# Altium schematic sheet TOWRP.SchDoc
size A; Organization: Smart Product Design Lab; Address1: 201 Thornton; Address2: Stanford University; Address3: Stanford, CA; Address4: 94305-4021
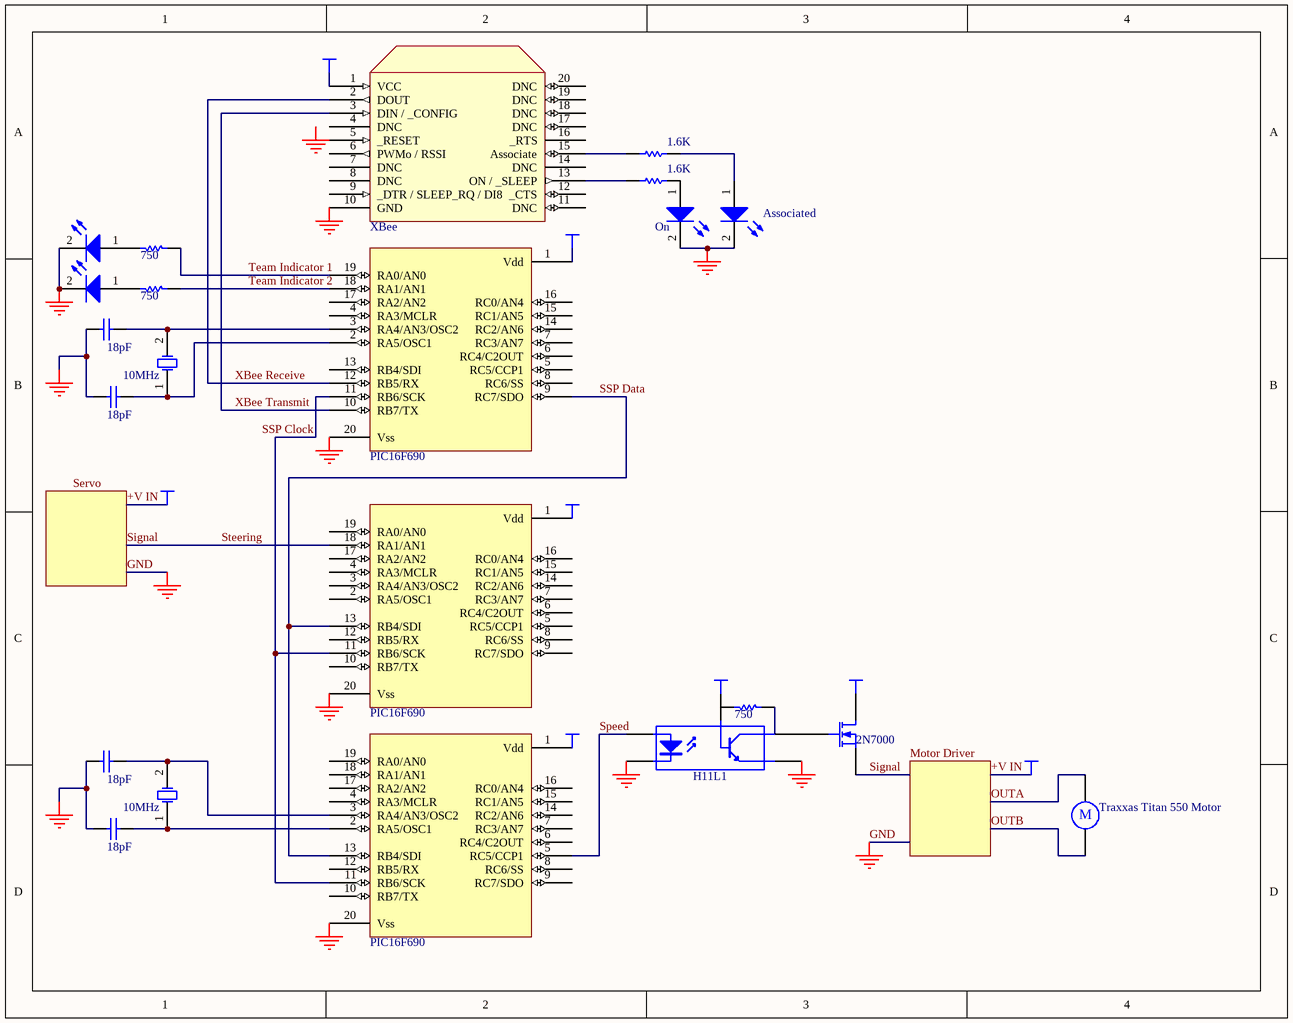
[diagram p0: TOWRP.SchDoc]

## Parts
(Parts that share a designator on the sheet are numbered #1, #2 ... from top to bottom, then left to right.)
?  Traxxas Titan 550 Motor  [RB5-10.5]
C5#1  value 18pF  [RAD-0.1]  (hidden comment: Cap)
C5#2  value 18pF  [RAD-0.1]  (hidden comment: Cap)
C6#1  value 18pF  [RAD-0.1]  (hidden comment: Cap)
C6#2  value 18pF  [RAD-0.1]  (hidden comment: Cap)
D1  On  [LED]
D2  Associated  [LED]
D3  On  [LED]  (value not drawn)
D4  On  [LED]  (value not drawn)
Q?  2N7000  [BCY-W3/H.8]
R1  value 1.6K  [RAD-0.1]  (hidden comment: Res1)
R2  value 1.6K  [RAD-0.1]  (hidden comment: Res1)
R3#1  value 750  [RAD-0.1]  (hidden comment: Res1)
R3#2  value 750  [RAD-0.1]  (hidden comment: Res1)
R4  value 750  [RAD-0.1]  (hidden comment: Res1)
U2  XBee  [XBee sockets]
U3#1  (no value)  [DIP-20]
U3#2  (no value)  [DIP-20]
U3#3  (no value)  [DIP-20]
U?  H11L1  [SO-G5/P.95]
Y1#1  10MHz  [BCY-W2/D3.1]
Y1#2  10MHz  [BCY-W2/D3.1]

## Nets
+3.3: U2.1(VCC) U3#1.1(Vdd)
+V IN: Q?.1(D) U3#2.1(Vdd) U3#3.1(Vdd) U?.3(B)  [also labelled +5, +7.2]
GND: C5#1.2 C5#2.2 C6#1.2 C6#2.2 D1.2(K) D2.2(K) D3.2(K) D4.2(K) U2.10(GND) U3#1.20(Vss) U3#2.20(Vss) U3#3.20(Vss) U?.2(K) U?.5(E)
OUTA: ?.1
OUTB: ?.2
Signal: Q?.3(S) U3#2.18(RA1/AN1)  [also labelled Steering]
Speed: U3#3.5(RC5/CCP1) U?.1(A)
SSP Data: U3#1.9(RC7/SDO) U3#2.13(RB4/SDI) U3#3.13(RB4/SDI)
Team Indicator 1: R3#1.2 U3#1.19(RA0/AN0)
Team Indicator 2: R4.2 U3#1.18(RA1/AN1)
XBee Receive: U2.2(DOUT) U3#1.12(RB5/RX)
XBee Transmit: U2.3(DIN_/__CONFIG) U3#1.10(RB7/TX)
NetC5#1_1: C5#1.1 U3#1.3(RA4/AN3/OSC2) Y1#1.2(OSC2)
NetC5#2_1: C5#2.1 U3#3.3(RA4/AN3/OSC2) Y1#2.2(OSC2)
NetC6#1_1: C6#1.1 U3#1.2(RA5/OSC1) Y1#1.1(OSC1)
NetC6#2_1: C6#2.1 U3#3.2(RA5/OSC1) Y1#2.1(OSC1)
NetD1_1: D1.1(A) R2.2
NetD2_1: D2.1(A) R1.2
NetD3_1: D3.1(A) R3#1.1
NetD4_1: D4.1(A) R4.1
NetQ?_2: Q?.2(G) U?.4(C)
NetR1_1: R1.1 U2.15(Associate)
NetR2_1: R2.1 U2.13(ON_/__SLEEP)
NetU3#1_11: U3#1.11(RB6/SCK) U3#2.11(RB6/SCK) U3#3.11(RB6/SCK)

Not connected (* = marked no-connect by the designer): R3#2 1 2; U2 4(DNC) 5(_RESET) 6(PWMo_/_RSSI) 7(DNC) 8(DNC) 9(_DTR_/_SLEEP_RQ_/_DI8) 11(DNC) 12(_CTS) 14(DNC) 16(_RTS) 17(DNC) 18(DNC) 19(DNC) 20(DNC); U3#1 4(RA3/MCLR) 5(RC5/CCP1) 6(RC4/C2OUT) 7(RC3/AN7) 8(RC6/SS) 13(RB4/SDI) 14(RC2/AN6) 15(RC1/AN5) 16(RC0/AN4) 17(RA2/AN2); U3#2 2(RA5/OSC1) 3(RA4/AN3/OSC2) 4(RA3/MCLR) 5(RC5/CCP1) 6(RC4/C2OUT) 7(RC3/AN7) 8(RC6/SS) 9(RC7/SDO) 10(RB7/TX) 12(RB5/RX) 14(RC2/AN6) 15(RC1/AN5) 16(RC0/AN4) 17(RA2/AN2) 19(RA0/AN0); U3#3 4(RA3/MCLR) 6(RC4/C2OUT) 7(RC3/AN7) 8(RC6/SS) 9(RC7/SDO) 10(RB7/TX) 12(RB5/RX) 14(RC2/AN6) 15(RC1/AN5) 16(RC0/AN4) 17(RA2/AN2) 18(RA1/AN1) 19(RA0/AN0)

## Notes on the sheet
- Labels drawn without touching a wire or pin: GND, Motor Driver, Servo, SSP Clock
- Title
- Size:
- Date:
- File:
- A
- Number:
- Time:
- Revision:
- Sheet
- of
- Drawn By:
- (in symbol Motor) M

## Library data of the parts
? = Motor: Motor, General Kind; Manufacturer: Generic Components; Published: 1999
C5#1 C5#2 C6#1 C6#2 = Cap: Capacitor; Manufacturer: Generic Components; Class: Passive; Published: 08/06/2000; Publisher: Altium Hobart Technology Centre; SubClass: Capacitor
D1 D3 D4 = LED1: HLMP1700; Manufacturer: Generic Components; Class: Optoelectronic; Published: 08/06/2000; Publisher: Altium Hobart Technology Centre; SubClass: LED
D2 = LED1: HLMP1790; Manufacturer: Generic Components; Class: Optoelectronic; Published: 08/06/2000; Publisher: Altium Hobart Technology Centre; SubClass: LED
Q? = MOSFET-N: N-Channel MOSFET; Manufacturer: Generic Components; Class: Discrete; SubClass: MOSFET - Low Power; Published: 08/06/2000; Publisher: Altium Hobart Technology Centre
R1 R2 R3#1 R3#2 R4 = Res1: Resistor; Manufacturer: Generic Components; Class: Passive; Published: 08/06/2000; Publisher: Altium Hobart Technology Centre; SubClass: Resistor
U2 = XBee: MaxStream Zibee RF radio module
U3#1-U3#3 = PIC16F690
U? = Optoisolator2: Optoisolator; Manufacturer: Generic Components; Class: Optoelectronic; Published: 1999
Y1#1 Y1#2 = XTAL: Crystal Oscillator; Manufacturer: Generic Components; Published: 08/06/2000; Publisher: Altium Hobart Technology Centre; Class: Oscillator; SubClass: Crystal Oscillator